# EAGLE design Sensor_HallArray_StandAlone_2mm (EAGLE 9.6.2)
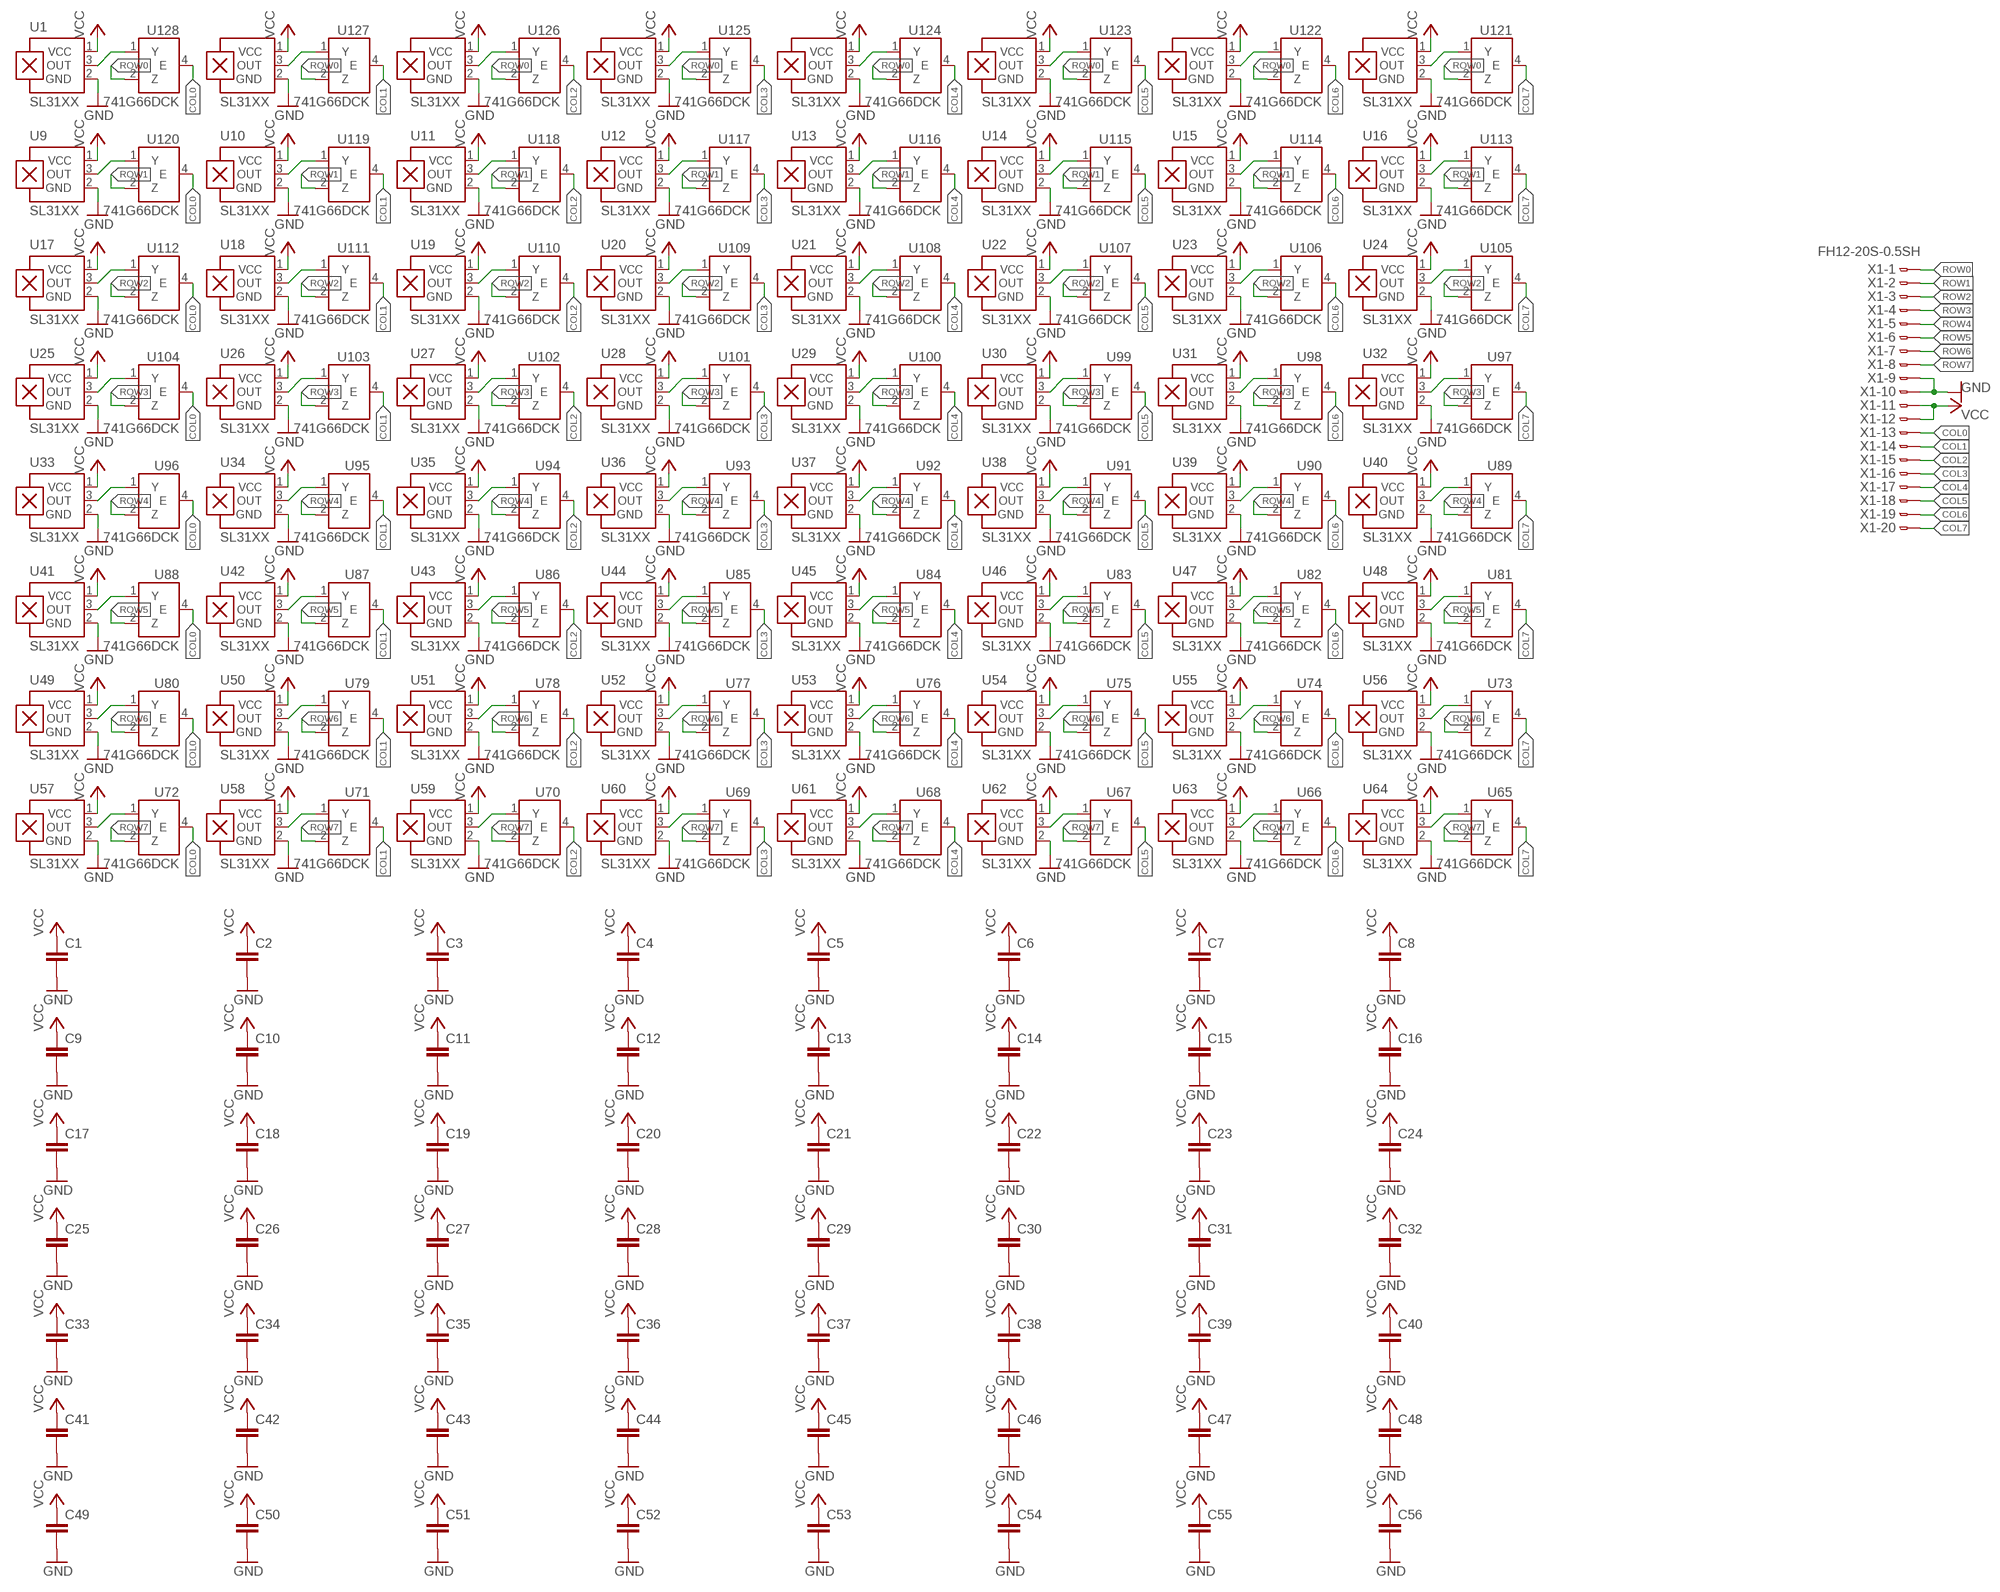
[diagram p0: schematic, sheet 1]

## Parts
C1  C-EUC0201  [C0201]
C2  C-EUC0201  [C0201]
C3  C-EUC0201  [C0201]
C4  C-EUC0201  [C0201]
C5  C-EUC0201  [C0201]
C6  C-EUC0201  [C0201]
C7  C-EUC0201  [C0201]
C8  C-EUC0201  [C0201]
C9  C-EUC0201  [C0201]
C10  C-EUC0201  [C0201]
C11  C-EUC0201  [C0201]
C12  C-EUC0201  [C0201]
C13  C-EUC0201  [C0201]
C14  C-EUC0201  [C0201]
C15  C-EUC0201  [C0201]
C16  C-EUC0201  [C0201]
C17  C-EUC0201  [C0201]
C18  C-EUC0201  [C0201]
C19  C-EUC0201  [C0201]
C20  C-EUC0201  [C0201]
C21  C-EUC0201  [C0201]
C22  C-EUC0201  [C0201]
C23  C-EUC0201  [C0201]
C24  C-EUC0201  [C0201]
C25  C-EUC0201  [C0201]
C26  C-EUC0201  [C0201]
C27  C-EUC0201  [C0201]
C28  C-EUC0201  [C0201]
C29  C-EUC0201  [C0201]
C30  C-EUC0201  [C0201]
C31  C-EUC0201  [C0201]
C32  C-EUC0201  [C0201]
C33  C-EUC0201  [C0201]
C34  C-EUC0201  [C0201]
C35  C-EUC0201  [C0201]
C36  C-EUC0201  [C0201]
C37  C-EUC0201  [C0201]
C38  C-EUC0201  [C0201]
C39  C-EUC0201  [C0201]
C40  C-EUC0201  [C0201]
C41  C-EUC0201  [C0201]
C42  C-EUC0201  [C0201]
C43  C-EUC0201  [C0201]
C44  C-EUC0201  [C0201]
C45  C-EUC0201  [C0201]
C46  C-EUC0201  [C0201]
C47  C-EUC0201  [C0201]
C48  C-EUC0201  [C0201]
C49  C-EUC0201  [C0201]
C50  C-EUC0201  [C0201]
C51  C-EUC0201  [C0201]
C52  C-EUC0201  [C0201]
C53  C-EUC0201  [C0201]
C54  C-EUC0201  [C0201]
C55  C-EUC0201  [C0201]
C56  C-EUC0201  [C0201]
U1  SL31XX  [SOT1215]
U2  SL31XX  [SOT1215]
U3  SL31XX  [SOT1215]
U4  SL31XX  [SOT1215]
U5  SL31XX  [SOT1215]
U6  SL31XX  [SOT1215]
U7  SL31XX  [SOT1215]
U8  SL31XX  [SOT1215]
U9  SL31XX  [SOT1215]
U10  SL31XX  [SOT1215]
U11  SL31XX  [SOT1215]
U12  SL31XX  [SOT1215]
U13  SL31XX  [SOT1215]
U14  SL31XX  [SOT1215]
U15  SL31XX  [SOT1215]
U16  SL31XX  [SOT1215]
U17  SL31XX  [SOT1215]
U18  SL31XX  [SOT1215]
U19  SL31XX  [SOT1215]
U20  SL31XX  [SOT1215]
U21  SL31XX  [SOT1215]
U22  SL31XX  [SOT1215]
U23  SL31XX  [SOT1215]
U24  SL31XX  [SOT1215]
U25  SL31XX  [SOT1215]
U26  SL31XX  [SOT1215]
U27  SL31XX  [SOT1215]
U28  SL31XX  [SOT1215]
U29  SL31XX  [SOT1215]
U30  SL31XX  [SOT1215]
U31  SL31XX  [SOT1215]
U32  SL31XX  [SOT1215]
U33  SL31XX  [SOT1215]
U34  SL31XX  [SOT1215]
U35  SL31XX  [SOT1215]
U36  SL31XX  [SOT1215]
U37  SL31XX  [SOT1215]
U38  SL31XX  [SOT1215]
U39  SL31XX  [SOT1215]
U40  SL31XX  [SOT1215]
U41  SL31XX  [SOT1215]
U42  SL31XX  [SOT1215]
U43  SL31XX  [SOT1215]
U44  SL31XX  [SOT1215]
U45  SL31XX  [SOT1215]
U46  SL31XX  [SOT1215]
U47  SL31XX  [SOT1215]
U48  SL31XX  [SOT1215]
U49  SL31XX  [SOT1215]
U50  SL31XX  [SOT1215]
U51  SL31XX  [SOT1215]
U52  SL31XX  [SOT1215]
U53  SL31XX  [SOT1215]
U54  SL31XX  [SOT1215]
U55  SL31XX  [SOT1215]
U56  SL31XX  [SOT1215]
U57  SL31XX  [SOT1215]
U58  SL31XX  [SOT1215]
U59  SL31XX  [SOT1215]
U60  SL31XX  [SOT1215]
U61  SL31XX  [SOT1215]
U62  SL31XX  [SOT1215]
U63  SL31XX  [SOT1215]
U64  SL31XX  [SOT1215]
U65  741G66DCK  [SC70-5]
U66  741G66DCK  [SC70-5]
U67  741G66DCK  [SC70-5]
U68  741G66DCK  [SC70-5]
U69  741G66DCK  [SC70-5]
U70  741G66DCK  [SC70-5]
U71  741G66DCK  [SC70-5]
U72  741G66DCK  [SC70-5]
U73  741G66DCK  [SC70-5]
U74  741G66DCK  [SC70-5]
U75  741G66DCK  [SC70-5]
U76  741G66DCK  [SC70-5]
U77  741G66DCK  [SC70-5]
U78  741G66DCK  [SC70-5]
U79  741G66DCK  [SC70-5]
U80  741G66DCK  [SC70-5]
U81  741G66DCK  [SC70-5]
U82  741G66DCK  [SC70-5]
U83  741G66DCK  [SC70-5]
U84  741G66DCK  [SC70-5]
U85  741G66DCK  [SC70-5]
U86  741G66DCK  [SC70-5]
U87  741G66DCK  [SC70-5]
U88  741G66DCK  [SC70-5]
U89  741G66DCK  [SC70-5]
U90  741G66DCK  [SC70-5]
U91  741G66DCK  [SC70-5]
U92  741G66DCK  [SC70-5]
U93  741G66DCK  [SC70-5]
U94  741G66DCK  [SC70-5]
U95  741G66DCK  [SC70-5]
U96  741G66DCK  [SC70-5]
U97  741G66DCK  [SC70-5]
U98  741G66DCK  [SC70-5]
U99  741G66DCK  [SC70-5]
U100  741G66DCK  [SC70-5]
U101  741G66DCK  [SC70-5]
U102  741G66DCK  [SC70-5]
U103  741G66DCK  [SC70-5]
U104  741G66DCK  [SC70-5]
U105  741G66DCK  [SC70-5]
U106  741G66DCK  [SC70-5]
U107  741G66DCK  [SC70-5]
U108  741G66DCK  [SC70-5]
U109  741G66DCK  [SC70-5]
U110  741G66DCK  [SC70-5]
U111  741G66DCK  [SC70-5]
U112  741G66DCK  [SC70-5]
U113  741G66DCK  [SC70-5]
U114  741G66DCK  [SC70-5]
U115  741G66DCK  [SC70-5]
U116  741G66DCK  [SC70-5]
U117  741G66DCK  [SC70-5]
U118  741G66DCK  [SC70-5]
U119  741G66DCK  [SC70-5]
U120  741G66DCK  [SC70-5]
U121  741G66DCK  [SC70-5]
U122  741G66DCK  [SC70-5]
U123  741G66DCK  [SC70-5]
U124  741G66DCK  [SC70-5]
U125  741G66DCK  [SC70-5]
U126  741G66DCK  [SC70-5]
U127  741G66DCK  [SC70-5]
U128  741G66DCK  [SC70-5]
X1  FH12-20S-0.5SH  [FH12-20S-0.5SH]

## Nets
COL0: U72.4(E) U80.4(E) U88.4(E) U96.4(E) U104.4(E) U112.4(E) U120.4(E) U128.4(E) X1.13
COL1: U71.4(E) U79.4(E) U87.4(E) U95.4(E) U103.4(E) U111.4(E) U119.4(E) U127.4(E) X1.14
COL2: U70.4(E) U78.4(E) U86.4(E) U94.4(E) U102.4(E) U110.4(E) U118.4(E) U126.4(E) X1.15
COL3: U69.4(E) U77.4(E) U85.4(E) U93.4(E) U101.4(E) U109.4(E) U117.4(E) U125.4(E) X1.16
COL4: U68.4(E) U76.4(E) U84.4(E) U92.4(E) U100.4(E) U108.4(E) U116.4(E) U124.4(E) X1.17
COL5: U67.4(E) U75.4(E) U83.4(E) U91.4(E) U99.4(E) U107.4(E) U115.4(E) U123.4(E) X1.18
COL6: U66.4(E) U74.4(E) U82.4(E) U90.4(E) U98.4(E) U106.4(E) U114.4(E) U122.4(E) X1.19
COL7: U65.4(E) U73.4(E) U81.4(E) U89.4(E) U97.4(E) U105.4(E) U113.4(E) U121.4(E) X1.20
GND: C1.2 C2.2 C3.2 C4.2 C5.2 C6.2 C7.2 C8.2 C9.2 C10.2 C11.2 C12.2 C13.2 C14.2 C15.2 C16.2 C17.2 C18.2 C19.2 C20.2 C21.2 C22.2 C23.2 C24.2 C25.2 C26.2 C27.2 C28.2 C29.2 C30.2 C31.2 C32.2 C33.2 C34.2 C35.2 C36.2 C37.2 C38.2 C39.2 C40.2 C41.2 C42.2 C43.2 C44.2 C45.2 C46.2 C47.2 C48.2 C49.2 C50.2 C51.2 C52.2 C53.2 C54.2 C55.2 C56.2 U1.2(GND) U2.2(GND) U3.2(GND) U4.2(GND) U5.2(GND) U6.2(GND) U7.2(GND) U8.2(GND) U9.2(GND) U10.2(GND) U11.2(GND) U12.2(GND) U13.2(GND) U14.2(GND) U15.2(GND) U16.2(GND) U17.2(GND) U18.2(GND) U19.2(GND) U20.2(GND) U21.2(GND) U22.2(GND) U23.2(GND) U24.2(GND) U25.2(GND) U26.2(GND) U27.2(GND) U28.2(GND) U29.2(GND) U30.2(GND) U31.2(GND) U32.2(GND) U33.2(GND) U34.2(GND) U35.2(GND) U36.2(GND) U37.2(GND) U38.2(GND) U39.2(GND) U40.2(GND) U41.2(GND) U42.2(GND) U43.2(GND) U44.2(GND) U45.2(GND) U46.2(GND) U47.2(GND) U48.2(GND) U49.2(GND) U50.2(GND) U51.2(GND) U52.2(GND) U53.2(GND) U54.2(GND) U55.2(GND) U56.2(GND) U57.2(GND) U58.2(GND) U59.2(GND) U60.2(GND) U61.2(GND) U62.2(GND) U63.2(GND) U64.2(GND) X1.9 X1.10
N$00001: U1.3(OUT) U128.1(Y)
N$00002: U2.3(OUT) U127.1(Y)
N$00003: U9.3(OUT) U120.1(Y)
N$00004: U3.3(OUT) U126.1(Y)
N$00005: U4.3(OUT) U125.1(Y)
N$00006: U5.3(OUT) U124.1(Y)
N$00007: U6.3(OUT) U123.1(Y)
N$00008: U7.3(OUT) U122.1(Y)
N$00009: U8.3(OUT) U121.1(Y)
N$00010: U10.3(OUT) U119.1(Y)
N$00011: U11.3(OUT) U118.1(Y)
N$00012: U12.3(OUT) U117.1(Y)
N$00013: U13.3(OUT) U116.1(Y)
N$00014: U14.3(OUT) U115.1(Y)
N$00015: U15.3(OUT) U114.1(Y)
N$00016: U16.3(OUT) U113.1(Y)
N$00017: U17.3(OUT) U112.1(Y)
N$00018: U18.3(OUT) U111.1(Y)
N$00019: U19.3(OUT) U110.1(Y)
N$00020: U20.3(OUT) U109.1(Y)
N$00021: U21.3(OUT) U108.1(Y)
N$00022: U22.3(OUT) U107.1(Y)
N$00023: U23.3(OUT) U106.1(Y)
N$00024: U24.3(OUT) U105.1(Y)
N$00025: U25.3(OUT) U104.1(Y)
N$00026: U26.3(OUT) U103.1(Y)
N$00029: U27.3(OUT) U102.1(Y)
N$00030: U28.3(OUT) U101.1(Y)
N$00031: U29.3(OUT) U100.1(Y)
N$00032: U30.3(OUT) U99.1(Y)
N$00033: U31.3(OUT) U98.1(Y)
N$00034: U32.3(OUT) U97.1(Y)
N$00035: U33.3(OUT) U96.1(Y)
N$00036: U34.3(OUT) U95.1(Y)
N$00037: U35.3(OUT) U94.1(Y)
N$00038: U36.3(OUT) U93.1(Y)
N$00039: U37.3(OUT) U92.1(Y)
N$00040: U38.3(OUT) U91.1(Y)
N$00041: U39.3(OUT) U90.1(Y)
N$00042: U40.3(OUT) U89.1(Y)
N$00043: U41.3(OUT) U88.1(Y)
N$00045: U42.3(OUT) U87.1(Y)
N$00046: U43.3(OUT) U86.1(Y)
N$00047: U44.3(OUT) U85.1(Y)
N$00048: U45.3(OUT) U84.1(Y)
N$00049: U46.3(OUT) U83.1(Y)
N$00051: U47.3(OUT) U82.1(Y)
N$00052: U48.3(OUT) U81.1(Y)
N$00053: U49.3(OUT) U80.1(Y)
N$00054: U50.3(OUT) U79.1(Y)
N$00055: U51.3(OUT) U78.1(Y)
N$00056: U52.3(OUT) U77.1(Y)
N$00057: U53.3(OUT) U76.1(Y)
N$00058: U54.3(OUT) U75.1(Y)
N$00059: U55.3(OUT) U74.1(Y)
N$00060: U56.3(OUT) U73.1(Y)
N$00061: U57.3(OUT) U72.1(Y)
N$00062: U58.3(OUT) U71.1(Y)
N$00063: U59.3(OUT) U70.1(Y)
N$00064: U60.3(OUT) U69.1(Y)
N$00065: U61.3(OUT) U68.1(Y)
N$00066: U62.3(OUT) U67.1(Y)
N$00067: U63.3(OUT) U66.1(Y)
N$00068: U64.3(OUT) U65.1(Y)
ROW0: U121.2(Z) U122.2(Z) U123.2(Z) U124.2(Z) U125.2(Z) U126.2(Z) U127.2(Z) U128.2(Z) X1.1
ROW1: U113.2(Z) U114.2(Z) U115.2(Z) U116.2(Z) U117.2(Z) U118.2(Z) U119.2(Z) U120.2(Z) X1.2
ROW2: U105.2(Z) U106.2(Z) U107.2(Z) U108.2(Z) U109.2(Z) U110.2(Z) U111.2(Z) U112.2(Z) X1.3
ROW3: U97.2(Z) U98.2(Z) U99.2(Z) U100.2(Z) U101.2(Z) U102.2(Z) U103.2(Z) U104.2(Z) X1.4
ROW4: U89.2(Z) U90.2(Z) U91.2(Z) U92.2(Z) U93.2(Z) U94.2(Z) U95.2(Z) U96.2(Z) X1.5
ROW5: U81.2(Z) U82.2(Z) U83.2(Z) U84.2(Z) U85.2(Z) U86.2(Z) U87.2(Z) U88.2(Z) X1.6
ROW6: U73.2(Z) U74.2(Z) U75.2(Z) U76.2(Z) U77.2(Z) U78.2(Z) U79.2(Z) U80.2(Z) X1.7
ROW7: U65.2(Z) U66.2(Z) U67.2(Z) U68.2(Z) U69.2(Z) U70.2(Z) U71.2(Z) U72.2(Z) X1.8
VCC: C1.1 C2.1 C3.1 C4.1 C5.1 C6.1 C7.1 C8.1 C9.1 C10.1 C11.1 C12.1 C13.1 C14.1 C15.1 C16.1 C17.1 C18.1 C19.1 C20.1 C21.1 C22.1 C23.1 C24.1 C25.1 C26.1 C27.1 C28.1 C29.1 C30.1 C31.1 C32.1 C33.1 C34.1 C35.1 C36.1 C37.1 C38.1 C39.1 C40.1 C41.1 C42.1 C43.1 C44.1 C45.1 C46.1 C47.1 C48.1 C49.1 C50.1 C51.1 C52.1 C53.1 C54.1 C55.1 C56.1 U1.1(VCC) U2.1(VCC) U3.1(VCC) U4.1(VCC) U5.1(VCC) U6.1(VCC) U7.1(VCC) U8.1(VCC) U9.1(VCC) U10.1(VCC) U11.1(VCC) U12.1(VCC) U13.1(VCC) U14.1(VCC) U15.1(VCC) U16.1(VCC) U17.1(VCC) U18.1(VCC) U19.1(VCC) U20.1(VCC) U21.1(VCC) U22.1(VCC) U23.1(VCC) U24.1(VCC) U25.1(VCC) U26.1(VCC) U27.1(VCC) U28.1(VCC) U29.1(VCC) U30.1(VCC) U31.1(VCC) U32.1(VCC) U33.1(VCC) U34.1(VCC) U35.1(VCC) U36.1(VCC) U37.1(VCC) U38.1(VCC) U39.1(VCC) U40.1(VCC) U41.1(VCC) U42.1(VCC) U43.1(VCC) U44.1(VCC) U45.1(VCC) U46.1(VCC) U47.1(VCC) U48.1(VCC) U49.1(VCC) U50.1(VCC) U51.1(VCC) U52.1(VCC) U53.1(VCC) U54.1(VCC) U55.1(VCC) U56.1(VCC) U57.1(VCC) U58.1(VCC) U59.1(VCC) U60.1(VCC) U61.1(VCC) U62.1(VCC) U63.1(VCC) U64.1(VCC) X1.11 X1.12

## Power pins joined to a net without a drawn wire
GND: U65.3(GND) U66.3(GND) U67.3(GND) U68.3(GND) U69.3(GND) U70.3(GND) U71.3(GND) U72.3(GND) U73.3(GND) U74.3(GND) U75.3(GND) U76.3(GND) U77.3(GND) U78.3(GND) U79.3(GND) U80.3(GND) U81.3(GND) U82.3(GND) U83.3(GND) U84.3(GND) U85.3(GND) U86.3(GND) U87.3(GND) U88.3(GND) U89.3(GND) U90.3(GND) U91.3(GND) U92.3(GND) U93.3(GND) U94.3(GND) U95.3(GND) U96.3(GND) U97.3(GND) U98.3(GND) U99.3(GND) U100.3(GND) U101.3(GND) U102.3(GND) U103.3(GND) U104.3(GND) U105.3(GND) U106.3(GND) U107.3(GND) U108.3(GND) U109.3(GND) U110.3(GND) U111.3(GND) U112.3(GND) U113.3(GND) U114.3(GND) U115.3(GND) U116.3(GND) U117.3(GND) U118.3(GND) U119.3(GND) U120.3(GND) U121.3(GND) U122.3(GND) U123.3(GND) U124.3(GND) U125.3(GND) U126.3(GND) U127.3(GND) U128.3(GND)
VCC: U65.5(VCC) U66.5(VCC) U67.5(VCC) U68.5(VCC) U69.5(VCC) U70.5(VCC) U71.5(VCC) U72.5(VCC) U73.5(VCC) U74.5(VCC) U75.5(VCC) U76.5(VCC) U77.5(VCC) U78.5(VCC) U79.5(VCC) U80.5(VCC) U81.5(VCC) U82.5(VCC) U83.5(VCC) U84.5(VCC) U85.5(VCC) U86.5(VCC) U87.5(VCC) U88.5(VCC) U89.5(VCC) U90.5(VCC) U91.5(VCC) U92.5(VCC) U93.5(VCC) U94.5(VCC) U95.5(VCC) U96.5(VCC) U97.5(VCC) U98.5(VCC) U99.5(VCC) U100.5(VCC) U101.5(VCC) U102.5(VCC) U103.5(VCC) U104.5(VCC) U105.5(VCC) U106.5(VCC) U107.5(VCC) U108.5(VCC) U109.5(VCC) U110.5(VCC) U111.5(VCC) U112.5(VCC) U113.5(VCC) U114.5(VCC) U115.5(VCC) U116.5(VCC) U117.5(VCC) U118.5(VCC) U119.5(VCC) U120.5(VCC) U121.5(VCC) U122.5(VCC) U123.5(VCC) U124.5(VCC) U125.5(VCC) U126.5(VCC) U127.5(VCC) U128.5(VCC)

## Library data of the parts
C1-C56 = rcl:C-EU: CAPACITOR, European symbol; SPICEPREFIX: C
U1-U64 = misc:SL31XX: SL31xx Linear Hall Sensor
U65-U128 = 74xx-little-de:74*1G66: Single Analog / Bilateral Switch Source: http://www.semiconductors.philips.com/acrobat_download/datasheets/74HC_HCT1G66_3.pdf
X1 = con-hirose:FH12-20S-0.5S: 0.5mm Pitch Connectors For FPC/FFC Source: Data sheet <http://www.hirose.co.jp/cataloge_hp/e58605370.pdf>; MPN: FH12-20S-0.5SH(55); OC_FARNELL: 1324549; OC_NEWARK: 34M6166

## Board
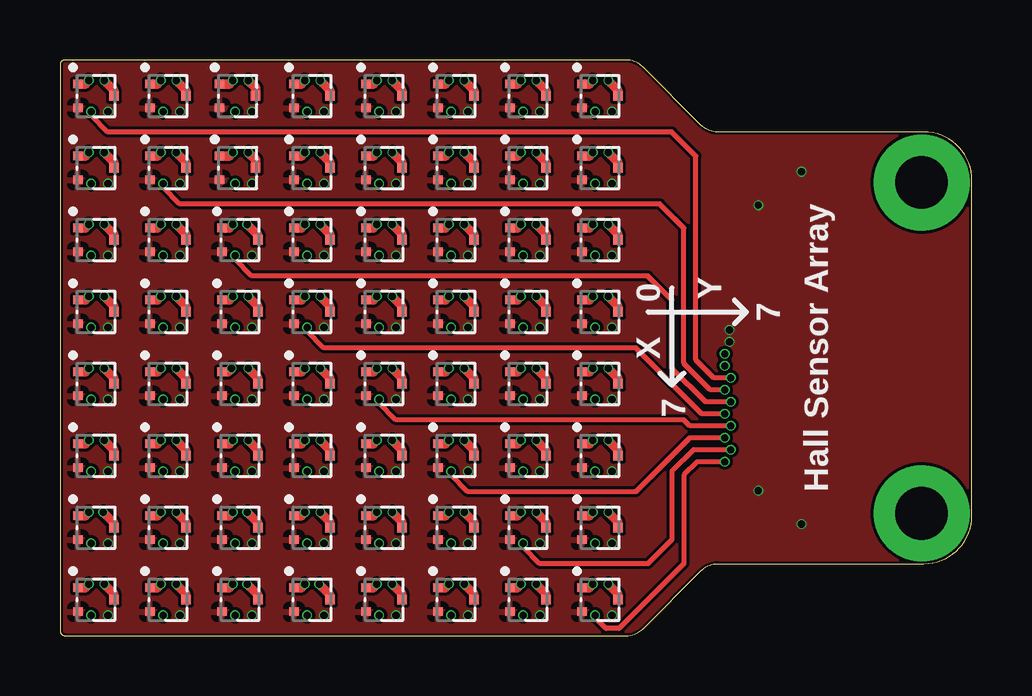
[diagram p1: board, top side]
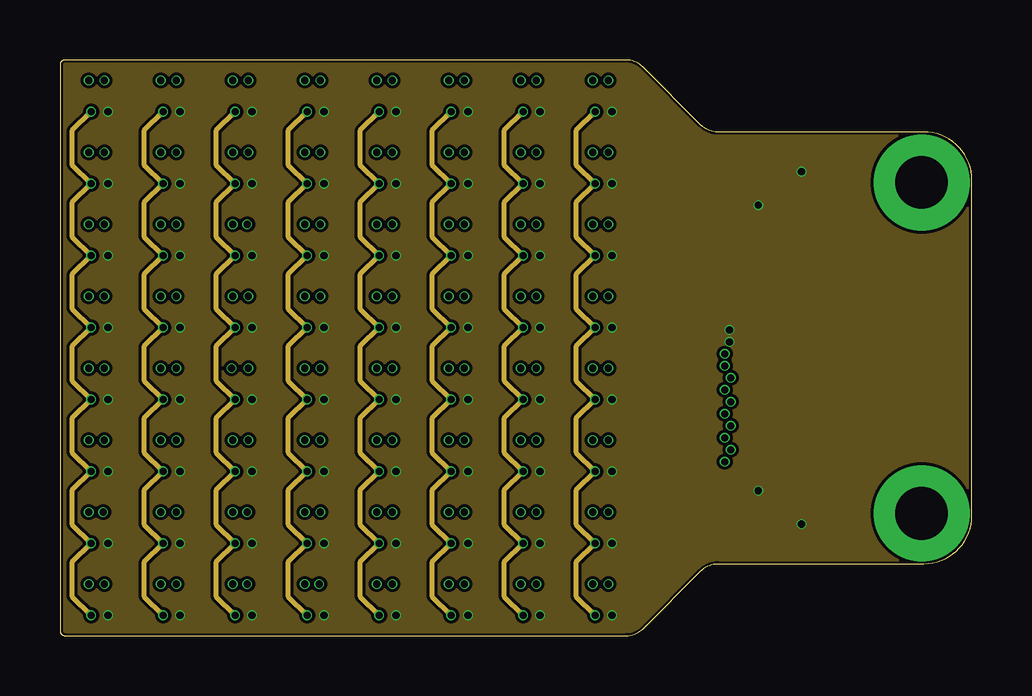
[diagram p2: board, inner layer Route2]
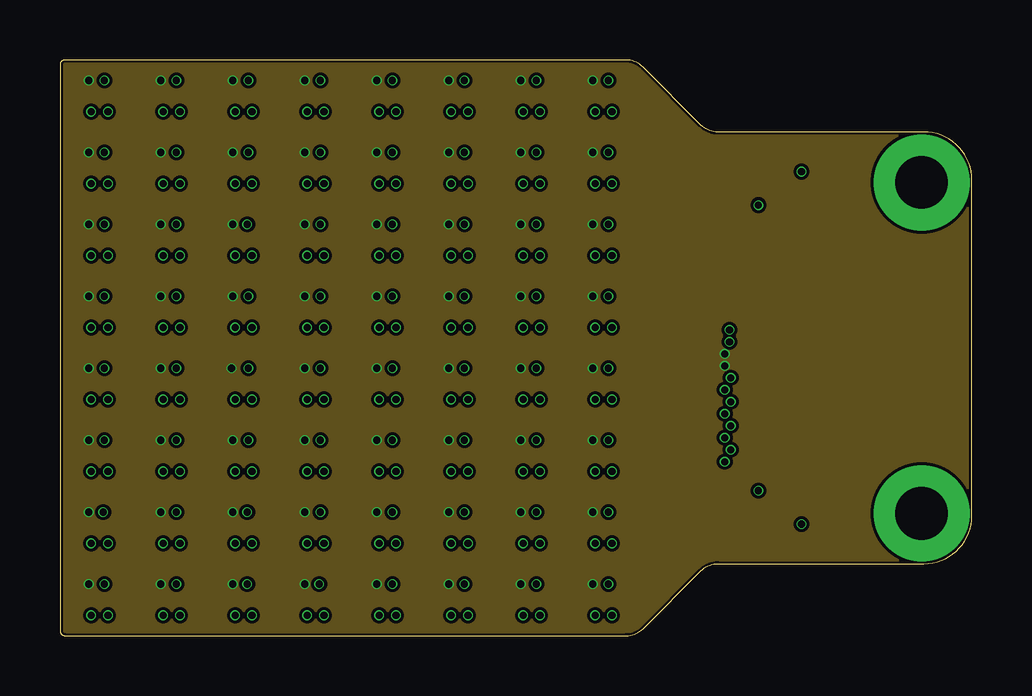
[diagram p3: board, inner layer Route15]
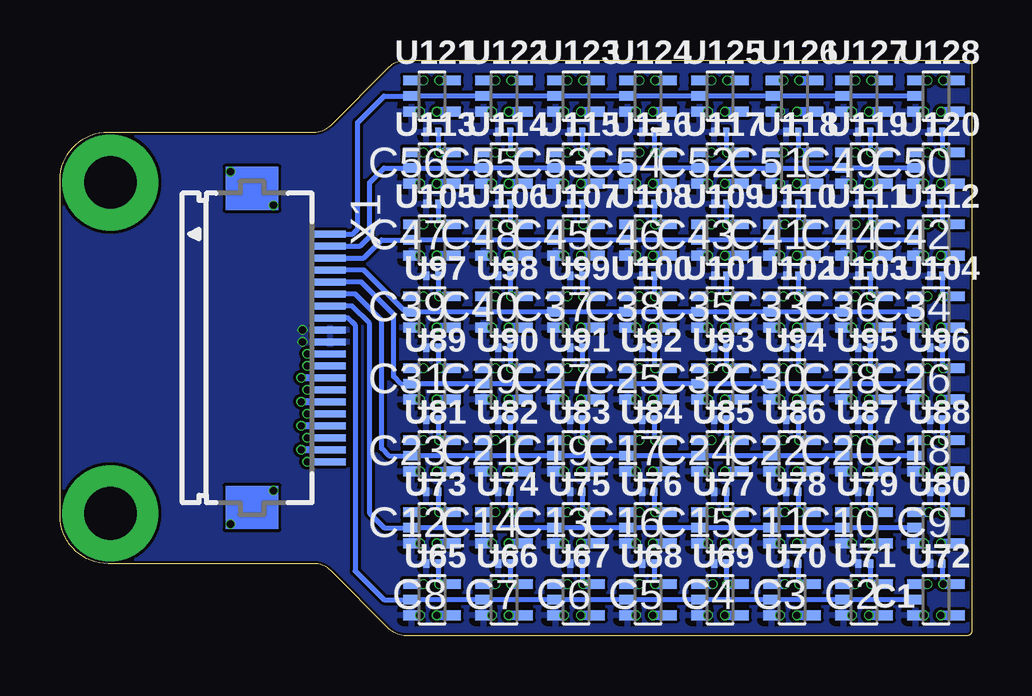
[diagram p4: board, bottom side, seen from below]

Size 38 x 24 mm. Coordinates in mm from the lower left corner, seen from the top.
Outline: 27.41,3 36,3 arc90 38,5 38,19 arc90 36,21 27.41,21 arc-45 26.71,21.29 24.29,23.71 arc45 23.59,24 0.2,24.01 arc88 0,23.81 0,0.19 arc90 0.2,0 23.59,0 arc45 24.29,0.29 26.71,2.71 arc-45 27.41,3
Copper layers (1*2*15*16): Top 0.035559375mm / dielectric 0.17018125mm / Route2 0.01778125mm / dielectric 47mil / Route15 0.01778125mm / dielectric 0.17018125mm / Bottom 0.035559375mm
Design rules "jlcpcb-4-layer *": minimum track width 5mil, minimum drill 0.2mm, track to track 5mil, track to pad 5mil, pad to pad 5mil, via to via 5mil, smd to smd 0mil, copper to edge 0.1mm, drill to drill 5mil, minimum pad ring 0.1mm, minimum via ring 0.05mm, stop-mask expansion 3mil, vias tented up to drill 100mil, thermal gap 10mil

### Footprints (pad centres in the part's own frame; a part is rotated, then mirrored left to right if it is on the bottom)
C0201 = smd 0.25 x 0.35: 1 -0.25,0; 2 0.25,0
SOT1215 = smd 0.35 x 0.4: 1 0.5,0.75; 2 -0.5,0.75 | smd 0.4 x 0.4: 3 0,-0.75
SC70-5 = smd 0.4 x 0.7: 1 -0.65,-0.85; 2 0,-0.85; 3 0.65,-0.85; 4 0.65,0.85; 5 -0.65,0.85
FH12-20S-0.5SH = smd 0.3 x 1.3: 1 -4.75,3.25; 2 -4.25,3.25; 3 -3.75,3.25; 4 -3.25,3.25; 5 -2.75,3.25; 6 -2.25,3.25; 7 -1.75,3.25; 8 -1.25,3.25; 9 -0.75,3.25; 10 -0.25,3.25; 11 0.25,3.25; 12 0.75,3.25; 13 1.25,3.25; 14 1.75,3.25; 15 2.25,3.25; 16 2.75,3.25; 17 3.25,3.25; 18 3.75,3.25; 19 4.25,3.25; 20 4.75,3.25

### Placement (x,y rotation side)
C1  1.5,3 180 bottom
C2  4.5,3 180 bottom
C3  7.5,3 180 bottom
C4  10.5,3 180 bottom
C5  13.5,3 180 bottom
C6  16.5,3 180 bottom
C7  19.5,3 180 bottom
C8  22.5,3 180 bottom
C9  1.5,6 180 bottom
C10  4.5,6 180 bottom
C11  7.5,6 180 bottom
C12  22.5,6 180 bottom
C13  16.5,6 180 bottom
C14  19.5,6 180 bottom
C15  10.5,6 180 bottom
C16  13.5,6 180 bottom
C17  13.5,9 180 bottom
C18  1.5,9 180 bottom
C19  16.5,9 180 bottom
C20  4.5,9 180 bottom
C21  19.5,9 180 bottom
C22  7.5,9 180 bottom
C23  22.5,9 180 bottom
C24  10.5,9 180 bottom
C25  13.5,12 180 bottom
C26  1.5,12 180 bottom
C27  16.5,12 180 bottom
C28  4.5,12 180 bottom
C29  19.5,12 180 bottom
C30  7.5,12 180 bottom
C31  22.5,12 180 bottom
C32  10.5,12 180 bottom
C33  7.5,15 180 bottom
C34  1.5,15 180 bottom
C35  10.5,15 180 bottom
C36  4.5,15 180 bottom
C37  16.5,15 180 bottom
C38  13.5,15 180 bottom
C39  22.5,15 180 bottom
C40  19.5,15 180 bottom
C41  7.5,18 180 bottom
C42  1.5,18 180 bottom
C43  10.5,18 180 bottom
C44  4.5,18 180 bottom
C45  16.5,18 180 bottom
C46  13.5,18 180 bottom
C47  22.5,18 180 bottom
C48  19.5,18 180 bottom
C49  4.5,21 180 bottom
C50  1.5,21 180 bottom
C51  7.5,21 180 bottom
C52  10.5,21 180 bottom
C53  16.5,21 180 bottom
C54  13.5,21 180 bottom
C55  19.5,21 180 bottom
C56  22.5,21 180 bottom
U1  1.5,22.5 90 top
U2  4.5,22.5 90 top
U3  7.4,22.5 90 top
U4  10.5,22.5 90 top
U5  13.5,22.5 90 top
U6  16.5,22.5 90 top
U7  19.5,22.5 90 top
U8  22.5,22.5 90 top
U9  1.5,19.5 90 top
U10  4.5,19.5 90 top
U11  7.4,19.5 90 top
U12  10.5,19.5 90 top
U13  13.5,19.5 90 top
U14  16.5,19.5 90 top
U15  19.5,19.5 90 top
U16  22.5,19.5 90 top
U17  1.5,16.5 90 top
U18  4.5,16.5 90 top
U19  7.5,16.5 90 top
U20  10.5,16.5 90 top
U21  13.5,16.5 90 top
U22  16.5,16.5 90 top
U23  19.5,16.5 90 top
U24  22.5,16.5 90 top
U25  1.5,13.5 90 top
U26  4.5,13.5 90 top
U27  7.5,13.5 90 top
U28  10.5,13.5 90 top
U29  13.5,13.5 90 top
U30  16.5,13.5 90 top
U31  19.5,13.5 90 top
U32  22.5,13.5 90 top
U33  1.5,10.5 90 top
U34  4.5,10.5 90 top
U35  7.5,10.5 90 top
U36  10.5,10.5 90 top
U37  13.5,10.5 90 top
U38  16.5,10.5 90 top
U39  19.5,10.5 90 top
U40  22.5,10.5 90 top
U41  1.5,7.5 90 top
U42  4.5,7.5 90 top
U43  7.5,7.5 90 top
U44  10.5,7.5 90 top
U45  13.5,7.5 90 top
U46  16.5,7.5 90 top
U47  19.5,7.5 90 top
U48  22.5,7.5 90 top
U49  1.5,4.5 90 top
U50  4.5,4.5 90 top
U51  7.5,4.5 90 top
U52  10.5,4.5 90 top
U53  13.5,4.5 90 top
U54  16.5,4.5 90 top
U55  19.5,4.5 90 top
U56  22.5,4.5 90 top
U57  1.5,1.5 90 top
U58  4.5,1.5 90 top
U59  7.5,1.5 90 top
U60  10.5,1.5 90 top
U61  13.5,1.5 90 top
U62  16.5,1.5 90 top
U63  19.5,1.5 90 top
U64  22.5,1.5 90 top
U65  22.5,1.5 270 bottom
U66  19.5,1.5 270 bottom
U67  16.5,1.5 270 bottom
U68  13.5,1.5 270 bottom
U69  10.5,1.5 270 bottom
U70  7.5,1.5 270 bottom
U71  4.5,1.5 270 bottom
U72  1.5,1.5 270 bottom
U73  22.5,4.5 270 bottom
U74  19.5,4.5 270 bottom
U75  16.5,4.5 270 bottom
U76  13.5,4.5 270 bottom
U77  10.5,4.5 270 bottom
U78  7.5,4.5 270 bottom
U79  4.5,4.5 270 bottom
U80  1.5,4.5 270 bottom
U81  22.5,7.5 270 bottom
U82  19.5,7.5 270 bottom
U83  16.5,7.5 270 bottom
U84  13.5,7.5 270 bottom
U85  10.5,7.5 270 bottom
U86  7.5,7.5 270 bottom
U87  4.5,7.5 270 bottom
U88  1.5,7.5 270 bottom
U89  22.5,10.5 270 bottom
U90  19.5,10.5 270 bottom
U91  16.5,10.5 270 bottom
U92  13.5,10.5 270 bottom
U93  10.5,10.5 270 bottom
U94  7.5,10.5 270 bottom
U95  4.5,10.5 270 bottom
U96  1.5,10.5 270 bottom
U97  22.5,13.5 270 bottom
U98  19.5,13.5 270 bottom
U99  16.5,13.5 270 bottom
U100  13.5,13.5 270 bottom
U101  10.5,13.5 270 bottom
U102  7.5,13.5 270 bottom
U103  4.5,13.5 270 bottom
U104  1.5,13.5 270 bottom
U105  22.5,16.5 270 bottom
U106  19.5,16.5 270 bottom
U107  16.5,16.5 270 bottom
U108  13.5,16.5 270 bottom
U109  10.5,16.5 270 bottom
U110  7.5,16.5 270 bottom
U111  4.5,16.5 270 bottom
U112  1.5,16.5 270 bottom
U113  22.5,19.5 270 bottom
U114  19.5,19.5 270 bottom
U115  16.5,19.5 270 bottom
U116  13.5,19.5 270 bottom
U117  10.5,19.5 270 bottom
U118  7.4,19.5 270 bottom
U119  4.5,19.5 270 bottom
U120  1.5,19.5 270 bottom
U121  22.5,22.5 270 bottom
U122  19.5,22.5 270 bottom
U123  16.5,22.5 270 bottom
U124  13.5,22.5 270 bottom
U125  10.5,22.5 270 bottom
U126  7.4,22.5 270 bottom
U127  4.5,22.5 270 bottom
U128  1.5,22.5 270 bottom
X1  30,12 270 bottom

### Tracks (layer width: path | path; a pad name or v marks a point on that pad's centre or on a via)
COL0  (via drill 0.3)
  Top 0.2: v27.95,10.75 27.25,10.75 26.5,11.5 26.5,20 25.5,21 2,21 1.3,21.7 v1.3,21.85
  Route2 0.2: v1.3,21.85 0.5,21.05 0.5,19.65 v1.3,18.85 0.5,18.05 0.5,16.65 v1.3,15.85 0.5,15.05 0.5,13.65 v1.3,12.85 0.5,12.05 0.5,10.65 v1.3,9.85 0.5,9.05 0.5,7.65 v1.3,6.85 0.5,6.05 0.5,4.65 v1.3,3.85 0.5,3.05 0.5,1.65 v1.3,0.85
  Bottom 0.3: X1.13 v27.95,10.75
  Bottom 0.4: v1.3,21.85 U128.4 | v1.3,18.85 U120.4 | v1.3,15.85 U112.4 | v1.3,12.85 U104.4 | v1.3,9.85 U96.4 | v1.3,6.85 U88.4 | v1.3,3.85 U80.4 | v1.3,0.85 U72.4
COL1  (via drill 0.3)
  Top 0.2: v27.7,10.25 27.1,10.25 26,11.35 26,17 25,18 5,18 4.3,18.7 v4.3,18.85
  Route2 0.2: v4.3,21.85 3.5,21.05 3.5,19.65 v4.3,18.85 3.5,18.05 3.5,16.65 v4.3,15.85 3.5,15.05 3.5,13.65 v4.3,12.85 3.5,12.05 3.5,10.65 v4.3,9.85 3.5,9.05 3.5,7.65 v4.3,6.85 3.5,6.05 3.5,4.65 v4.3,3.85 3.5,3.05 3.5,1.65 v4.3,0.85
  Bottom 0.3: X1.14 v27.7,10.25
  Bottom 0.4: v4.3,21.85 U127.4 | v4.3,18.85 U119.4 | v4.3,15.85 U111.4 | v4.3,12.85 U103.4 | v4.3,9.85 U95.4 | v4.3,6.85 U87.4 | v4.3,3.85 U79.4 | v4.3,0.85 U71.4
COL2  (via drill 0.3)
  Top 0.2: v27.95,9.75 26.9,9.75 25.5,11.15 25.5,14 24.5,15 8,15 7.3,15.7 v7.3,15.85
  Route2 0.2: v7.3,21.85 6.5,21.05 6.5,19.65 v7.3,18.85 6.5,18.05 6.5,16.65 v7.3,15.85 6.5,15.05 6.5,13.65 v7.3,12.85 6.5,12.05 6.5,10.65 v7.3,9.85 6.5,9.05 6.5,7.65 v7.3,6.85 6.5,6.05 6.5,4.65 v7.3,3.85 6.5,3.05 6.5,1.65 v7.3,0.85
  Bottom 0.3: X1.15 v27.95,9.75
  Bottom 0.4: v7.3,21.85 U126.4 | v7.3,18.85 U118.4 | v7.3,15.85 U110.4 | v7.3,12.85 U102.4 | v7.3,9.85 U94.4 | v7.3,0.85 U70.4 | v7.3,3.85 U78.4 | v7.3,6.85 U86.4
COL3  (via drill 0.3)
  Top 0.2: v27.7,9.25 X1.16 24,12 11,12 10.3,12.7 v10.3,12.85
  Route2 0.2: v10.3,21.85 9.5,21.05 9.5,19.65 v10.3,18.85 9.5,18.05 9.5,16.65 v10.3,15.85 9.5,15.05 9.5,13.65 v10.3,12.85 9.5,12.05 9.5,10.65 v10.3,9.85 9.5,9.05 9.5,7.65 v10.3,6.85 9.5,6.05 9.5,4.65 v10.3,3.85 9.5,3.05 9.5,1.65 v10.3,0.85
  Bottom 0.3: X1.16 v27.7,9.25
  Bottom 0.4: v10.3,21.85 U125.4 | v10.3,18.85 U117.4 | v10.3,15.85 U109.4 | v10.3,12.85 U101.4 | v10.3,9.85 U93.4 | v10.3,6.85 U85.4 | v10.3,3.85 U77.4 | v10.3,0.85 U69.4
COL4  (via drill 0.3)
  Top 0.2: v27.95,8.75 26.25,8.75 26,9 14,9 13.3,9.7 v13.3,9.85
  Route2 0.2: v13.3,21.85 12.5,21.05 12.5,19.65 v13.3,18.85 12.5,18.05 12.5,16.65 v13.3,15.85 12.5,15.05 12.5,13.65 v13.3,12.85 12.5,12.05 12.5,10.65 v13.3,9.85 12.5,9.05 12.5,7.65 v13.3,6.85 12.5,6.05 12.5,4.65 v13.3,3.85 12.5,3.05 12.5,1.65 v13.3,0.85
  Bottom 0.3: X1.17 v27.95,8.75
  Bottom 0.4: v13.3,21.85 U124.4 | v13.3,18.85 U116.4 | v13.3,15.85 U108.4 | v13.3,12.85 U100.4 | v13.3,9.85 U92.4 | v13.3,6.85 U84.4 | v13.3,3.85 U76.4 | v13.3,0.85 U68.4
COL5  (via drill 0.3)
  Top 0.2: v27.7,8.25 26.25,8.25 24,6 17,6 16.3,6.7 v16.3,6.85
  Route2 0.2: v16.3,21.85 15.5,21.05 15.5,19.65 v16.3,18.85 15.5,18.05 15.5,16.65 v16.3,15.85 15.5,15.05 15.5,13.65 v16.3,12.85 15.5,12.05 15.5,10.65 v16.3,9.85 15.5,9.05 15.5,7.65 v16.3,6.85 15.5,6.05 15.5,4.65 v16.3,3.85 15.5,3.05 15.5,1.65 v16.3,0.85
  Bottom 0.3: X1.18 v27.7,8.25
  Bottom 0.4: v16.3,21.85 U123.4 | v16.3,18.85 U115.4 | v16.3,15.85 U107.4 | v16.3,12.85 U99.4 | v16.3,9.85 U91.4 | v16.3,0.85 U67.4 | v16.3,3.85 U75.4 | v16.3,6.85 U83.4
COL6  (via drill 0.3)
  Top 0.2: v27.95,7.75 26.4,7.75 25.5,6.85 25.5,4 24.5,3 20,3 19.3,3.7 v19.3,3.85
  Route2 0.2: v19.3,21.85 18.5,21.05 18.5,19.65 v19.3,18.85 18.5,18.05 18.5,16.65 v19.3,15.85 18.5,15.05 18.5,13.65 v19.3,12.85 18.5,12.05 18.5,10.65 v19.3,9.85 18.5,9.05 18.5,7.65 v19.3,6.85 18.5,6.05 18.5,4.65 v19.3,3.85 18.5,3.05 18.5,1.65 v19.3,0.85
  Bottom 0.3: X1.19 v27.95,7.75
  Bottom 0.4: v19.3,21.85 U122.4 | v19.3,18.85 U114.4 | v19.3,15.85 U106.4 | v19.3,12.85 U98.4 | v19.3,9.85 U90.4 | v19.3,6.85 U82.4 | v19.3,0.85 U66.4 | v19.3,3.85 U74.4
COL7  (via drill 0.3)
  Top 0.2: v27.7,7.25 26.55,7.25 26,6.7 26,3 23.3,0.3 22.75,0.3 22.3,0.75 v22.3,0.85
  Route2 0.2: v22.3,21.85 21.5,21.05 21.5,19.65 v22.3,18.85 21.5,18.05 21.5,16.65 v22.3,15.85 21.5,15.05 21.5,13.65 v22.3,12.85 21.5,12.05 21.5,10.65 v22.3,9.85 21.5,9.05 21.5,7.65 v22.3,6.85 21.5,6.05 21.5,4.65 v22.3,3.85 21.5,3.05 21.5,1.65 v22.3,0.85
  Bottom 0.3: X1.20 v27.7,7.25
  Bottom 0.4: v22.3,21.85 U121.4 | v22.3,18.85 U113.4 | v22.3,15.85 U105.4 | v22.3,12.85 U97.4 | v22.3,9.85 U89.4 | v22.3,6.85 U81.4 | v22.3,3.85 U73.4 | v22.3,0.85 U65.4
GND  (via drill 0.3)
  Bottom 0.4: U128.3 v2,21.85
  other vias: 5,21.85 8,21.85 11,21.85 14,21.85 17,21.85 20,21.85 23,21.85 23,18.85 20,18.85 17,18.85 14,18.85 11,18.85 8,18.85 5,18.85 2,18.85 2,15.85 5,15.85 8,15.85 11,15.85 14,15.85 17,15.85 20,15.85 23,15.85 23,12.85 20,12.85 17,12.85 14,12.85 11,12.85 8,12.85 5,12.85 2,12.85 2,9.85 2,6.85 2,3.85 2,0.85 5,0.85 5,3.85 5,6.85 5,9.85 8,9.85 8,6.85 8,3.85 8,0.85 11,0.85 11,3.85 11,6.85 11,9.85 14,9.85 14,6.85 14,3.85 14,0.85 17,0.85 17,3.85 17,6.85 17,9.85 20,9.85 20,6.85 20,3.85 20,0.85 23,0.85 23,3.85 23,6.85 23,9.85 27.9,12.75 27.9,12.25 30.9,19.35 29.1,17.95 29.1,6.05 30.9,4.65
  pour Top: 0,0 24,0 27,3 36,3 arc90 38,5 38,19 arc90 36,21 27,21 24,24 0,24
  pour Bottom: 0,0 24,0 27,3 36,3 arc90 38,5 38,19 arc90 36,21 27,21 24,24 0,24
  pour Route2: 0,0 24,0 27,3 36,3 arc90 38,5 38,19 arc90 36,21 27,21 24,24 0,24
N$00001  (via drill 0.3)
  Top 0.4: U1.3 2.25,22.75 v1.85,23.15
  Bottom 0.4: v1.85,23.15 U128.1
N$00002  (via drill 0.3)
  Top 0.4: U2.3 5.25,22.75 v4.85,23.15
  Bottom 0.4: U127.1 v4.85,23.15
N$00003  (via drill 0.3)
  Top 0.4: U9.3 2.25,19.75 v1.85,20.15
  Bottom 0.4: U120.1 v1.85,20.15
N$00004  (via drill 0.3)
  Top 0.4: U3.3 8.15,22.85 v7.85,23.15
  Bottom 0.4: U126.1 v7.85,23.15
N$00005  (via drill 0.3)
  Top 0.4: U4.3 11.25,22.75 v10.85,23.15
  Bottom 0.4: U125.1 v10.85,23.15
N$00006  (via drill 0.3)
  Top 0.4: v13.85,23.15 14.25,22.75 U5.3
  Bottom 0.4: U124.1 v13.85,23.15
N$00007  (via drill 0.3)
  Top 0.4: v16.85,23.15 17.25,22.75 U6.3
  Bottom 0.4: U123.1 v16.85,23.15
N$00008  (via drill 0.3)
  Top 0.4: v19.85,23.15 20.25,22.75 U7.3
  Bottom 0.4: U122.1 v19.85,23.15
N$00009  (via drill 0.3)
  Top 0.4: v22.85,23.15 23.25,22.75 U8.3
  Bottom 0.4: U121.1 v22.85,23.15
N$00010  (via drill 0.3)
  Top 0.4: U10.3 5.25,19.75 v4.85,20.15
  Bottom 0.4: U119.1 v4.85,20.15
N$00011  (via drill 0.3)
  Top 0.4: v7.85,20.15 8.15,19.85 U11.3
  Bottom 0.4: U118.1 v7.85,20.15
N$00012  (via drill 0.3)
  Top 0.4: v10.85,20.15 11.25,19.75 U12.3
  Bottom 0.4: U117.1 v10.85,20.15
N$00013  (via drill 0.3)
  Top 0.4: v13.85,20.15 14.25,19.75 U13.3
  Bottom 0.4: U116.1 v13.85,20.15
N$00014  (via drill 0.3)
  Top 0.4: v16.85,20.15 17.25,19.75 U14.3
  Bottom 0.4: U115.1 v16.85,20.15
N$00015  (via drill 0.3)
  Top 0.4: v19.85,20.15 20.25,19.75 U15.3
  Bottom 0.4: U114.1 v19.85,20.15
N$00016  (via drill 0.3)
  Top 0.4: v22.85,20.15 23.25,19.75 U16.3
  Bottom 0.4: U113.1 v22.85,20.15
N$00017  (via drill 0.3)
  Top 0.4: v1.85,17.15 2.25,16.75 U17.3
  Bottom 0.4: U112.1 v1.85,17.15
N$00018  (via drill 0.3)
  Top 0.4: v4.85,17.15 5.25,16.75 U18.3
  Bottom 0.4: U111.1 v4.85,17.15
N$00019  (via drill 0.3)
  Top 0.4: v7.8,17.15 8.25,16.7 U19.3
  Bottom 0.4: U110.1 v7.8,17.15
N$00020  (via drill 0.3)
  Top 0.4: v10.85,17.15 11.25,16.75 U20.3
  Bottom 0.4: U109.1 v10.85,17.15
N$00021  (via drill 0.3)
  Top 0.4: v13.85,17.15 14.25,16.75 U21.3
  Bottom 0.4: U108.1 v13.85,17.15
N$00022  (via drill 0.3)
  Top 0.4: v16.85,17.15 17.25,16.75 U22.3
  Bottom 0.4: U107.1 v16.85,17.15
N$00023  (via drill 0.3)
  Top 0.4: v19.85,17.15 20.25,16.75 U23.3
  Bottom 0.4: U106.1 v19.85,17.15
N$00024  (via drill 0.3)
  Top 0.4: v22.85,17.15 23.25,16.75 U24.3
  Bottom 0.4: U105.1 v22.85,17.15
N$00025  (via drill 0.3)
  Top 0.4: v1.85,14.15 2.25,13.75 U25.3
  Bottom 0.4: U104.1 v1.85,14.15
N$00026  (via drill 0.3)
  Top 0.4: v4.85,14.15 5.25,13.75 U26.3
  Bottom 0.4: U103.1 v4.85,14.15
N$00027  (via drill 2.2 pad 4)
  other vias: 35.9,18.9
N$00028  (via drill 2.2 pad 4)
  other vias: 35.9,5.1
N$00029  (via drill 0.3)
  Top 0.4: v7.85,14.15 8.25,13.75 U27.3
  Bottom 0.4: U102.1 v7.85,14.15
N$00030  (via drill 0.3)
  Top 0.4: v10.85,14.15 11.25,13.75 U28.3
  Bottom 0.4: U101.1 v10.85,14.15
N$00031  (via drill 0.3)
  Top 0.4: v13.85,14.15 14.25,13.75 U29.3
  Bottom 0.4: U100.1 v13.85,14.15
N$00032  (via drill 0.3)
  Top 0.4: v16.85,14.15 17.25,13.75 U30.3
  Bottom 0.4: U99.1 v16.85,14.15
N$00033  (via drill 0.3)
  Top 0.4: v19.85,14.15 20.25,13.75 U31.3
  Bottom 0.4: U98.1 v19.85,14.15
N$00034  (via drill 0.3)
  Top 0.4: v22.85,14.15 23.25,13.75 U32.3
  Bottom 0.4: U97.1 v22.85,14.15
N$00035  (via drill 0.3)
  Top 0.4: v1.85,11.15 2.25,10.75 U33.3
  Bottom 0.4: U96.1 v1.85,11.15
N$00036  (via drill 0.3)
  Top 0.4: v4.85,11.15 5.25,10.75 U34.3
  Bottom 0.4: U95.1 v4.85,11.15
N$00037  (via drill 0.3)
  Top 0.4: v7.85,11.15 8.25,10.75 U35.3
  Bottom 0.4: U94.1 v7.85,11.15
N$00038  (via drill 0.3)
  Top 0.4: v10.85,11.15 11.25,10.75 U36.3
  Bottom 0.4: U93.1 v10.85,11.15
N$00039  (via drill 0.3)
  Top 0.4: v13.85,11.15 14.25,10.75 U37.3
  Bottom 0.4: U92.1 v13.85,11.15
N$00040  (via drill 0.3)
  Top 0.4: v16.85,11.15 17.25,10.75 U38.3
  Bottom 0.4: U91.1 v16.85,11.15
N$00041  (via drill 0.3)
  Top 0.4: v19.85,11.15 20.25,10.75 U39.3
  Bottom 0.4: U90.1 v19.85,11.15
N$00042  (via drill 0.3)
  Top 0.4: v22.85,11.15 23.25,10.75 U40.3
  Bottom 0.4: U89.1 v22.85,11.15
N$00043  (via drill 0.3)
  Top 0.4: v1.85,8.15 2.25,7.75 U41.3
  Bottom 0.4: U88.1 v1.85,8.15
N$00045  (via drill 0.3)
  Top 0.4: v4.85,8.15 5.25,7.75 U42.3
  Bottom 0.4: U87.1 v4.85,8.15
N$00046  (via drill 0.3)
  Top 0.4: v7.85,8.15 8.25,7.75 U43.3
  Bottom 0.4: U86.1 v7.85,8.15
N$00047  (via drill 0.3)
  Top 0.4: v10.85,8.15 11.25,7.75 U44.3
  Bottom 0.4: U85.1 v10.85,8.15
N$00048  (via drill 0.3)
  Top 0.4: v13.85,8.15 14.25,7.75 U45.3
  Bottom 0.4: U84.1 v13.85,8.15
N$00049  (via drill 0.3)
  Top 0.4: v16.85,8.15 17.25,7.75 U46.3
  Bottom 0.4: U83.1 v16.85,8.15
N$00051  (via drill 0.3)
  Top 0.4: v19.85,8.15 20.25,7.75 U47.3
  Bottom 0.4: U82.1 v19.85,8.15
N$00052  (via drill 0.3)
  Top 0.4: v22.85,8.15 23.25,7.75 U48.3
  Bottom 0.4: U81.1 v22.85,8.15
N$00053  (via drill 0.3)
  Top 0.4: v1.8,5.15 2.25,4.7 U49.3
  Bottom 0.4: U80.1 v1.8,5.15
N$00054  (via drill 0.3)
  Top 0.4: v4.85,5.15 5.25,4.75 U50.3
  Bottom 0.4: U79.1 v4.85,5.15
N$00055  (via drill 0.3)
  Top 0.4: v7.8,5.15 8.25,4.7 U51.3
  Bottom 0.4: U78.1 v7.8,5.15
N$00056  (via drill 0.3)
  Top 0.4: v10.85,5.15 11.25,4.75 U52.3
  Bottom 0.4: U77.1 v10.85,5.15
N$00057  (via drill 0.3)
  Top 0.4: v13.85,5.15 14.25,4.75 U53.3
  Bottom 0.4: U76.1 v13.85,5.15
N$00058  (via drill 0.3)
  Top 0.4: v16.85,5.15 17.25,4.75 U54.3
  Bottom 0.4: U75.1 v16.85,5.15
N$00059  (via drill 0.3)
  Top 0.4: v19.85,5.15 20.25,4.75 U55.3
  Bottom 0.4: U74.1 v19.85,5.15
N$00060  (via drill 0.3)
  Top 0.4: v22.85,5.15 23.25,4.75 U56.3
  Bottom 0.4: U73.1 v22.85,5.15
N$00061  (via drill 0.3)
  Top 0.4: v1.85,2.15 2.25,1.75 U57.3
  Bottom 0.4: U72.1 v1.85,2.15
N$00062  (via drill 0.3)
  Top 0.4: v4.85,2.15 5.25,1.75 U58.3
  Bottom 0.4: U71.1 v4.85,2.15
N$00063  (via drill 0.3)
  Top 0.4: v7.8,2.15 8.25,1.7 U59.3
  Bottom 0.4: U70.1 v7.8,2.15
N$00064  (via drill 0.3)
  Top 0.4: v10.8,2.15 11.25,1.7 U60.3
  Bottom 0.4: U69.1 v10.8,2.15
N$00065  (via drill 0.3)
  Top 0.4: v13.85,2.15 14.25,1.75 U61.3
  Bottom 0.4: U68.1 v13.85,2.15
N$00066  (via drill 0.3)
  Top 0.4: v16.85,2.15 17.25,1.75 U62.3
  Bottom 0.4: U67.1 v16.85,2.15
N$00067  (via drill 0.3)
  Top 0.4: v19.85,2.15 20.25,1.75 U63.3
  Bottom 0.4: U66.1 v19.85,2.15
N$00068  (via drill 0.3)
  Top 0.4: v22.85,2.15 23.25,1.75 U64.3
  Bottom 0.4: U65.1 v22.85,2.15
ROW0
  Bottom 0.2: U128.2 U127.2 U126.2 U125.2 U124.2 U123.2 U122.2 U121.2 24.5,22.5 25.6,21.4 25.6,16.95 25.8,16.75 X1.1
ROW1
  Bottom 0.2: U120.2 U119.2 U118.2 U117.2 U116.2 U115.2 U114.2 U113.2 24.5,19.5 25.1,18.9 25.1,16.65 25.5,16.25 X1.2
ROW2
  Bottom 0.2: U112.2 U111.2 U110.2 U109.2 U108.2 U107.2 U106.2 U105.2 24.6,16.5 25.35,15.75 X1.3
ROW3
  Bottom 0.2: U104.2 U103.2 U102.2 U101.2 U100.2 U99.2 U98.2 U97.2 23.3,13.45 23.55,13.45 25.35,15.25 X1.4
ROW4
  Bottom 0.2: U96.2 U95.2 U94.2 U93.2 U92.2 U91.2 U90.2 U89.2 23.8,10.5 24.1,10.8 24.1,13.4 25.45,14.75 X1.5
ROW5
  Bottom 0.2: U88.2 U87.2 U86.2 U85.2 U84.2 U83.2 U82.2 U81.2 24.3,7.5 24.6,7.8 24.6,13.15 25.7,14.25 X1.6
ROW6
  Bottom 0.2: U80.2 U79.2 U78.2 U77.2 U76.2 U75.2 U74.2 U73.2 24.5,4.5 25.1,5.1 25.1,13.01 25.84,13.75 X1.7
ROW7
  Bottom 0.2: U72.2 U71.2 U70.2 U69.2 U68.2 U67.2 U66.2 U65.2 24.5,1.5 25.7,2.7 25.7,12.95 25.87,13.12 25.9,13.15 26,13.25 X1.8
VCC  (via drill 0.3)
  Top 0.4: U10.1 4.05,20 v4.2,20.15 | U2.1 4.05,23 v4.2,23.15 | U1.1 1.05,23 v1.2,23.15 | U9.1 1.05,20 v1.2,20.15 | U3.1 7.05,23 v7.2,23.15 | U4.1 10.05,23 v10.2,23.15 | U11.1 7.05,20 v7.2,20.15 | U12.1 10.05,20 v10.2,20.15 | U13.1 13.05,20 v13.2,20.15 | U5.1 13.05,23 v13.2,23.15 | U14.1 16.05,20 v16.2,20.15 | U6.1 16.05,23 v16.2,23.15 | U15.1 19.05,20 v19.2,20.15 | U7.1 19.05,23 v19.2,23.15 | U8.1 22.05,23 v22.2,23.15 | U16.1 22.05,20 v22.2,20.15 | U17.1 1.05,17 v1.2,17.15 | U25.1 1.05,14 v1.2,14.15 | U26.1 4.05,14 v4.2,14.15 | U18.1 4.05,17 v4.2,17.15 | U19.1 7.05,17 v7.2,17.15 | U27.1 7.05,14 v7.2,14.15 | U28.1 10.05,14 v10.2,14.15 | U20.1 10.05,17 v10.2,17.15 | U21.1 13.05,17 v13.2,17.15 | U29.1 13.05,14 v13.2,14.15 | U30.1 16.05,14 v16.2,14.15 | U31.1 19.05,14 v19.2,14.15 | U23.1 19.05,17 v19.2,17.15 | U22.1 16.05,17 v16.2,17.15 | U24.1 22.05,17 v22.2,17.15 | U32.1 22.05,14 v22.2,14.15 | U40.1 22.05,11 v22.2,11.15 | U39.1 19.05,11 v19.2,11.15 | U38.1 16.05,11 v16.2,11.15 | U37.1 13.05,11 v13.2,11.15 | U36.1 10.05,11 v10.2,11.15 | U35.1 7,11 v7.15,11.15 | U34.1 4.05,11 v4.2,11.15 | U33.1 1.05,11 v1.2,11.15 | U41.1 1.05,8 v1.2,8.15 | U42.1 4.05,8 v4.2,8.15 | U43.1 7.05,8 v7.2,8.15 | U44.1 10.05,8 v10.2,8.15 | U45.1 13.05,8 v13.2,8.15 | U46.1 16.05,8 v16.2,8.15 | U47.1 19.05,8 v19.2,8.15 | U48.1 22.05,8 v22.2,8.15 | U56.1 22.05,5 v22.2,5.15 | U55.1 19.05,5 v19.2,5.15 | U54.1 16.05,5 v16.2,5.15 | U53.1 13.05,5 v13.2,5.15 | U52.1 10.05,5 v10.2,5.15 | U51.1 7.05,5 v7.2,5.15 | U50.1 4.05,5 v4.2,5.15 | U49.1 1.05,5 v1.2,5.15 | U57.1 1.05,2 v1.2,2.15 | U58.1 4.05,2 v4.2,2.15 | U59.1 7.05,2 v7.2,2.15 | U60.1 10.05,2 v10.2,2.15 | U61.1 13.05,2 v13.2,2.15 | U62.1 16.05,2 v16.2,2.15
  Top 0.4: U63.1 19.05,2 v19.2,2.15 | U64.1 22.05,2 v22.2,2.15
  Bottom 0.2: C8.1 22.25,2.2 v22.2,2.15 | C7.1 19.25,2.2 v19.2,2.15 | C6.1 16.25,2.2 v16.2,2.15 | C5.1 13.25,2.2 v13.2,2.15 | C4.1 10.25,2.2 v10.2,2.15 | C3.1 7.25,2.2 v7.2,2.15 | C2.1 4.25,2.2 v4.2,2.15 | C1.1 1.25,2.2 v1.2,2.15 | C56.1 22.25,20.2 v22.2,20.15 | C55.1 19.25,20.2 v19.2,20.15 | C53.1 16.25,20.2 v16.2,20.15 | C54.1 13.25,20.2 v13.2,20.15 | C52.1 10.25,20.2 v10.2,20.15 | C51.1 7.25,20.2 v7.2,20.15 | C49.1 4.25,20.2 v4.2,20.15 | C50.1 1.25,20.2 v1.2,20.15 | C42.1 1.25,17.2 v1.2,17.15 | C44.1 4.25,17.2 v4.2,17.15 | C41.1 7.25,17.2 v7.2,17.15 | C43.1 10.25,17.3 10.1,17.15 | C46.1 13.25,17.2 v13.2,17.15 | C45.1 16.25,17.2 v16.2,17.15 | C48.1 19.25,17.2 v19.2,17.15 | C47.1 22.25,17.2 v22.2,17.15 | C39.1 22.25,14.2 v22.2,14.15 | C40.1 19.25,14.2 v19.2,14.15 | C37.1 16.25,14.2 v16.2,14.15 | C38.1 13.25,14.2 v13.2,14.15 | C35.1 10.25,14.2 v10.2,14.15 | C33.1 7.25,14.2 v7.2,14.15 | C36.1 4.25,14.2 v4.2,14.15 | C34.1 1.25,14.2 v1.2,14.15 | C26.1 1.25,11.2 v1.2,11.15 | C28.1 4.25,11.2 v4.2,11.15 | C30.1 7.25,11.25 v7.15,11.15 | C32.1 10.25,11.2 v10.2,11.15 | C25.1 13.25,11.2 v13.2,11.15 | C27.1 16.25,11.2 v16.2,11.15 | C29.1 19.25,11.2 v19.2,11.15 | C31.1 22.25,11.2 v22.2,11.15 | C23.1 22.25,8.2 v22.2,8.15 | C21.1 19.25,8.2 v19.2,8.15 | C19.1 16.25,8.2 v16.2,8.15 | C17.1 13.25,8.2 v13.2,8.15 | C24.1 10.25,8.2 v10.2,8.15 | C22.1 7.25,8.2 v7.2,8.15 | C20.1 4.25,8.3 4.1,8.15 | C18.1 1.25,8.2 v1.2,8.15 | C9.1 1.25,5.2 v1.2,5.15 | C10.1 4.25,5.2 v4.2,5.15 | C11.1 7.25,5.2 v7.2,5.15 | C15.1 10.25,5.2 v10.2,5.15 | C16.1 13.25,5.2 v13.2,5.15 | C13.1 16.25,5.2 v16.2,5.15 | C14.1 19.25,5.2 v19.2,5.15 | C12.1 22.25,5.2 v22.2,5.15
  Bottom 0.3: v27.7,11.75 X1.11 | X1.12 v27.7,11.25
  Bottom 0.4: U127.5 v4.2,23.15 | U128.5 v1.2,23.15 | U126.5 v7.2,23.15 | v10.2,23.15 U125.5 | v13.2,23.15 U124.5 | v16.2,23.15 U123.5 | v19.2,23.15 U122.5 | v22.2,23.15 U121.5 | U113.5 v22.2,20.15 | U114.5 v19.2,20.15 | U115.5 v16.2,20.15 | U116.5 v13.2,20.15 | U117.5 v10.2,20.15 | U118.5 v7.2,20.15 | U119.5 v4.2,20.15 | U120.5 v1.2,20.15 | U72.5 v1.2,2.15 | U80.5 v1.2,5.15 | U79.5 v4.2,5.15 | U71.5 v4.2,2.15 | U88.5 v1.2,8.15 | U87.5 4.1,8.15 v4.2,8.15 | U95.5 v4.2,11.15 | U96.5 v1.2,11.15 | U104.5 v1.2,14.15 | U103.5 v4.2,14.15 | U102.5 v7.2,14.15 | U112.5 v1.2,17.15 | U111.5 v4.2,17.15 | U110.5 v7.2,17.15 | U109.5 10.1,17.15 v10.2,17.15 | U108.5 v13.2,17.15 | U107.5 v16.2,17.15 | U106.5 v19.2,17.15 | U105.5 v22.2,17.15 | U97.5 v22.2,14.15 | U98.5 v19.2,14.15 | U99.5 v16.2,14.15 | U100.5 v13.2,14.15 | U101.5 v10.2,14.15 | U93.5 v10.2,11.15 | U92.5 v13.2,11.15 | U94.5 v7.15,11.15 | U91.5 v16.2,11.15 | U90.5 v19.2,11.15 | U89.5 v22.2,11.15 | U81.5 v22.2,8.15 | U73.5 v22.2,5.15 | U74.5 v19.2,5.15 | U83.5 v16.2,8.15 | U84.5 v13.2,8.15 | U76.5 v13.2,5.15 | U75.5 v16.2,5.15 | U85.5 v10.2,8.15 | U86.5 v7.2,8.15 | U78.5 v7.2,5.15 | U77.5 v10.2,5.15 | U69.5 v10.2,2.15 | U70.5 v7.2,2.15 | U68.5 v13.2,2.15 | U67.5 v16.2,2.15 | U66.5 v19.2,2.15 | U65.5 v22.2,2.15 | U82.5 v19.2,8.15
  pour Route15: 0,0 24,0 24,0 27,3 36,3 arc90 38,5 38,19 arc90 36,21 27,21 24,24 0,24

### Text on the board
tNames: 0 | Y | 7 | X | Hall Sensor Array | 7